# Altium schematic sheet Extension_Connectors.SchDoc: Extensions connectors
size A3; Organization: Use Organization_Name in ProjParam; Address1: Eliot Ferragni; Address2: STI-MOBOTS; Address3: EPFL; Address4: CH-1015 LAUSANNE; DocumentNumber: 11; Revision: A; SheetNumber: 11; SheetTotal: 11; ApprovedBy: Init ApprovedBy in DocParam; CheckedBy: Init CheckedBy in DocParam; Author: Init Author in DocParam; CompanyName: Init CompanyName in DocParam; DrawnBy: Init DrawBy in DocParam; Engineer: Init Engineer in DocParam; Title2: Top and bottom extension connectors; DocumentName: Init DocumentName in DocParam; ProjectName: Init ProjectName in DocParam
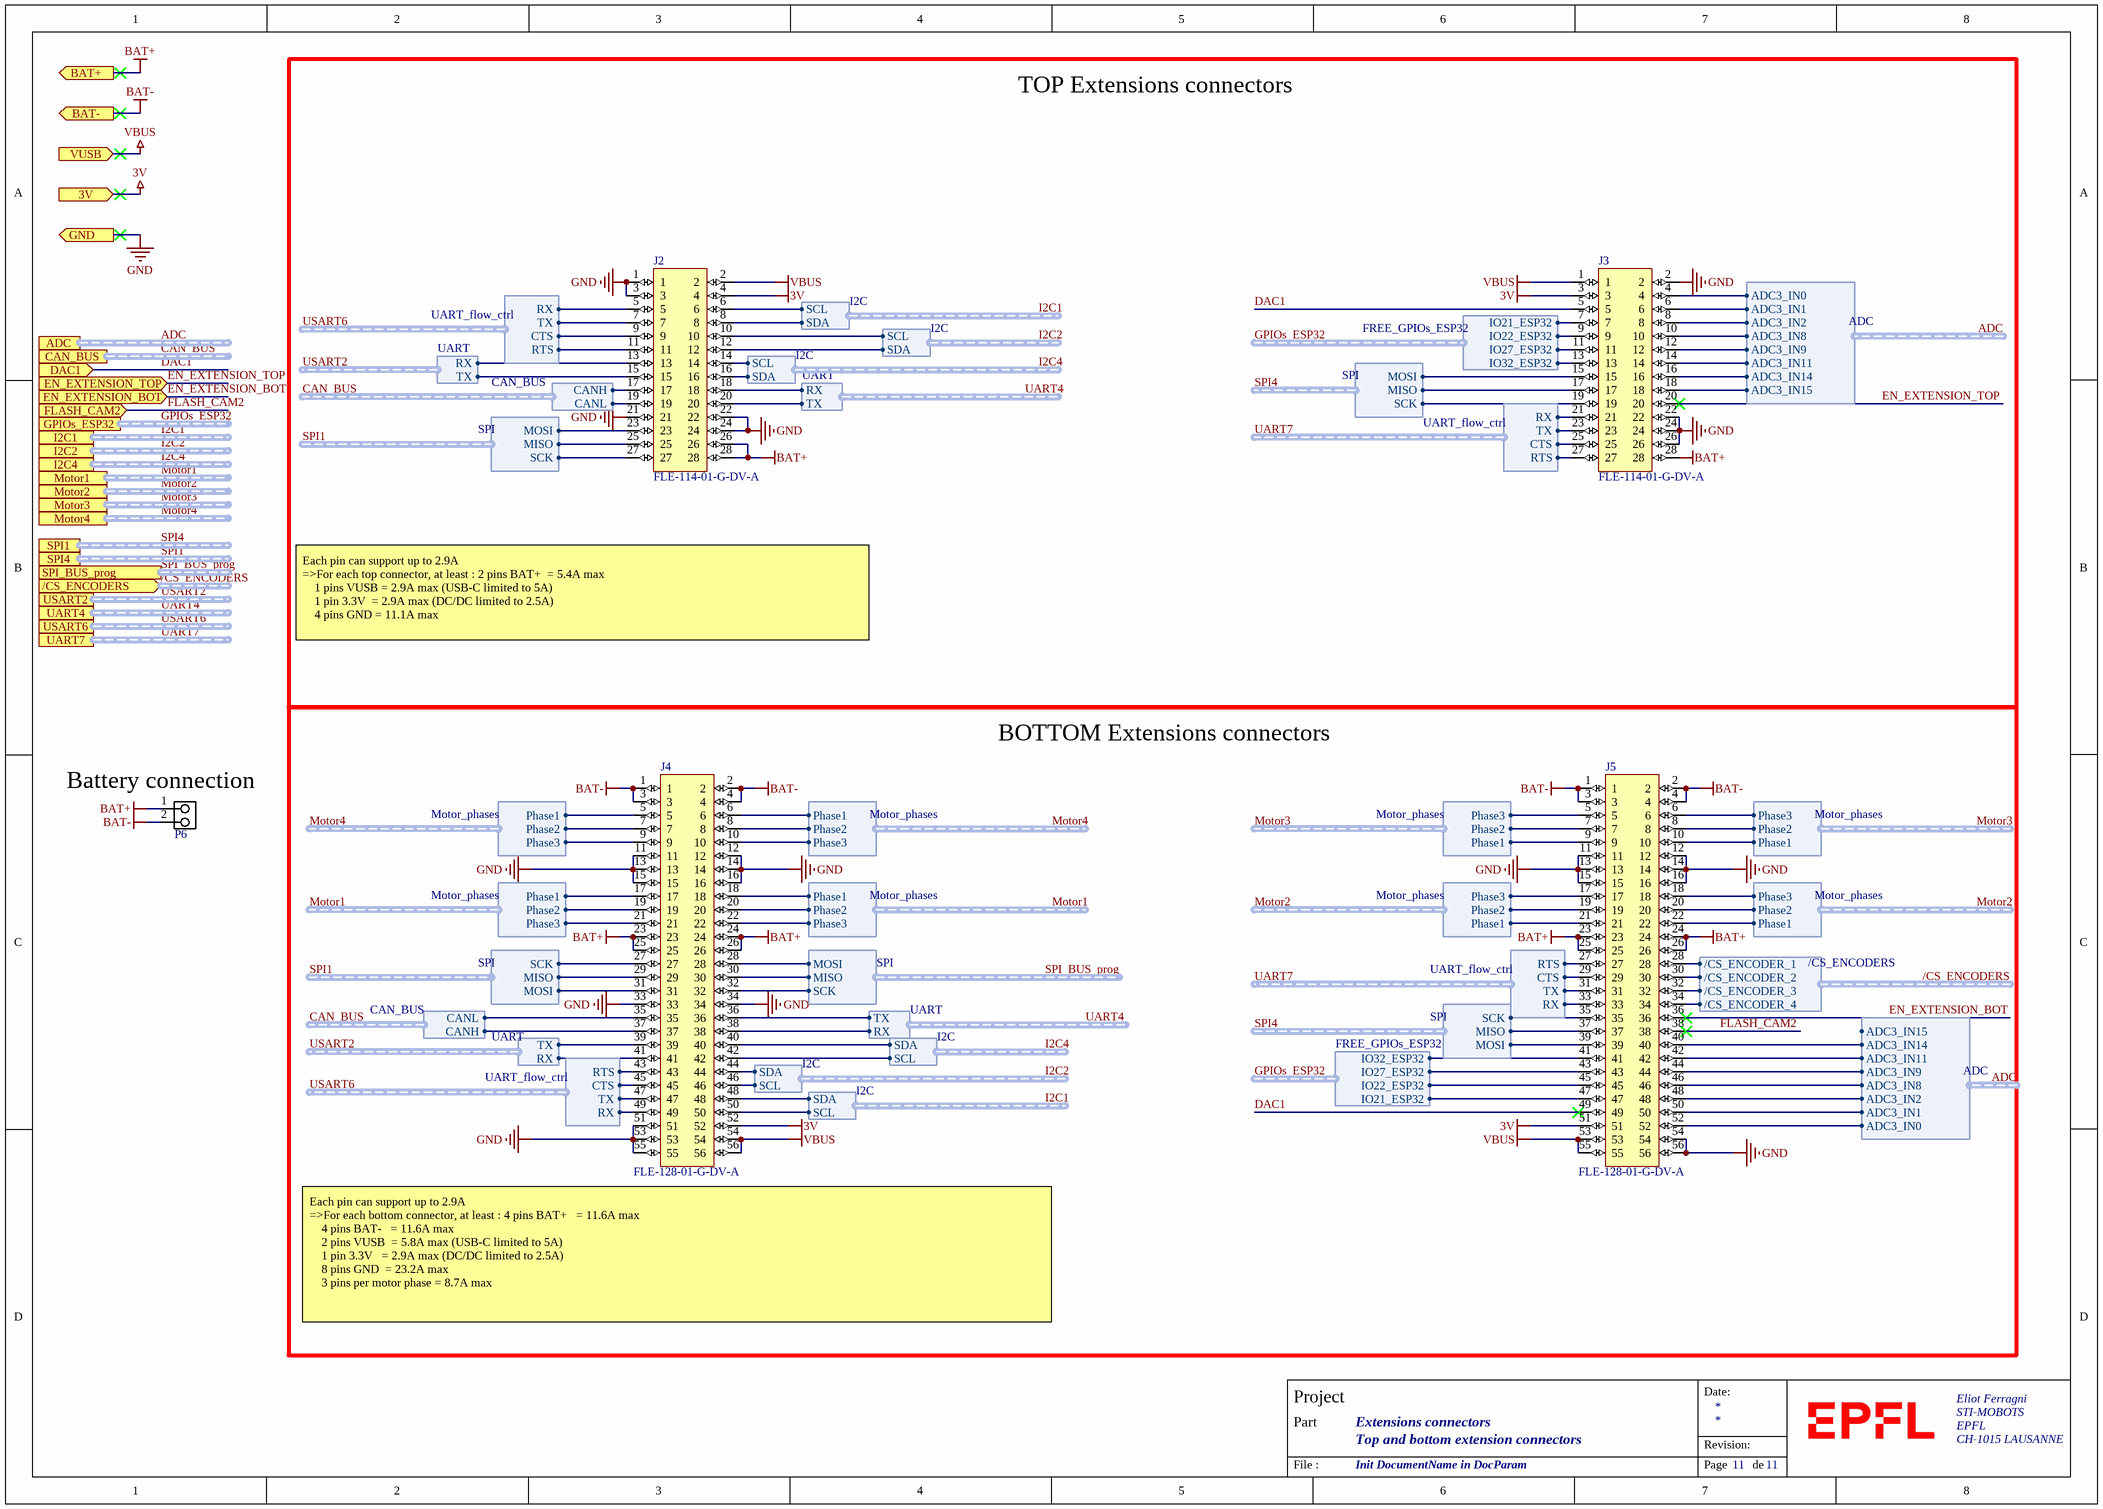
[diagram p0: Extension_Connectors.SchDoc]

## Parts
J2  FLE-114-01-G-DV-A  [FLE-114-01-G-DV-A]
J3  FLE-114-01-G-DV-A  [FLE-114-01-G-DV-A]
J4  FLE-128-01-G-DV-A  [FLE-128-01-G-DV-A]
J5  FLE-128-01-G-DV-A  [FLE-128-01-G-DV-A]
P6  2 power vias  [POWERVIAS_2]  (value not drawn)  (no BOM)

## Blocks framed on the sheet
TOP Extensions connectors: J2 J3
BOTTOM Extensions connectors: J4 J5

## Ports
3V (in), /CS_ENCODERS (in, harness /CS_ENCODERS), ADC (harness ADC), BAT+ (out), BAT- (out), CAN_BUS (harness CAN_BUS), DAC1 (in), EN_EXTENSION_BOT (in), EN_EXTENSION_TOP (in), FLASH_CAM2 (in), GND (out), GPIOs_ESP32 (harness FREE_GPIOs_ESP32), I2C1 (harness I2C), I2C2 (harness I2C), I2C4 (harness I2C), Motor1 (harness Motor_phases), Motor2 (harness Motor_phases), Motor3 (harness Motor_phases), Motor4 (harness Motor_phases), SPI1 (harness SPI), SPI4 (harness SPI), SPI_BUS_prog (harness SPI), UART4 (harness UART), UART7 (harness UART_flow_ctrl), USART2 (harness UART), USART6 (harness UART_flow_ctrl), VUSB (in)

## Harnesses
I2C: SDA, SCL
SPI: MISO, MOSI, SCK
UART_flow_ctrl: RX, TX, CTS, RTS
ADC: ADC3_IN0, ADC3_IN1, ADC3_IN2, ADC3_IN8, ADC3_IN9, ADC3_IN11, ADC3_IN14, ADC3_IN15
UART: RX, TX
CAN_BUS: CANL, CANH
/CS_ENCODERS: /CS_ENCODER_1, /CS_ENCODER_2, /CS_ENCODER_3, /CS_ENCODER_4
Motor_phases: Phase1, Phase2, Phase3
FREE_GPIOs_ESP32: IO22_ESP32, IO21_ESP32, IO27_ESP32, IO32_ESP32

## Nets
3V: J2.4 J3.3 J4.52 J5.51 ; port 3V
BAT+: J2.26 J2.28 J3.28 J4.23 J4.24 J4.25 J4.26 J5.23 J5.24 J5.25 J5.26 P6.1 ; port BAT+
BAT-: J4.1 J4.2 J4.3 J4.4 J5.1 J5.2 J5.3 J5.4 P6.2 ; port BAT-
GND: J2.1 J2.3 J2.21 J2.22 J2.24 J3.2 J3.22 J3.24 J3.26 J4.11 J4.12 J4.13 J4.14 J4.15 J4.16 J4.33 J4.34 J4.51 J4.53 J4.55 J5.11 J5.12 J5.13 J5.14 J5.15 J5.16 J5.54 J5.56 ; port GND
VBUS: J2.2 J3.1 J4.54 J4.56 J5.53 J5.55 ; port VUSB
/CS_ENCODERS./CS_ENCODER_1: J5.28 ; port /CS_ENCODERS./CS_ENCODER_1
/CS_ENCODERS./CS_ENCODER_2: J5.30 ; port /CS_ENCODERS./CS_ENCODER_2
/CS_ENCODERS./CS_ENCODER_3: J5.32 ; port /CS_ENCODERS./CS_ENCODER_3
/CS_ENCODERS./CS_ENCODER_4: J5.34 ; port /CS_ENCODERS./CS_ENCODER_4
ADC.ADC3_IN0: J3.4 J5.52 ; port ADC.ADC3_IN0
ADC.ADC3_IN1: J3.6 J5.50 ; port ADC.ADC3_IN1
ADC.ADC3_IN2: J3.8 J5.48 ; port ADC.ADC3_IN2
ADC.ADC3_IN8: J3.10 J5.46 ; port ADC.ADC3_IN8
ADC.ADC3_IN9: J3.12 J5.44 ; port ADC.ADC3_IN9
ADC.ADC3_IN11: J3.14 J5.42 ; port ADC.ADC3_IN11
ADC.ADC3_IN14: J3.16 J5.40 ; port ADC.ADC3_IN14
ADC.ADC3_IN15: J3.18 ; port ADC.ADC3_IN15
CAN_BUS.CANH: J2.17 J4.37 ; port CAN_BUS.CANH
CAN_BUS.CANL: J2.19 J4.35 ; port CAN_BUS.CANL
DAC1: J3.5 J5.49 ; port DAC1
EN_EXTENSION_BOT: J5.36 ; port EN_EXTENSION_BOT
EN_EXTENSION_TOP: J3.20 ; port EN_EXTENSION_TOP
FLASH_CAM2: J5.38 ; port FLASH_CAM2
GPIOs_ESP32.IO21_ESP32: J3.7 J5.47 ; port GPIOs_ESP32.IO21_ESP32
GPIOs_ESP32.IO22_ESP32: J3.9 J5.45 ; port GPIOs_ESP32.IO22_ESP32
GPIOs_ESP32.IO27_ESP32: J3.11 J5.43 ; port GPIOs_ESP32.IO27_ESP32
GPIOs_ESP32.IO32_ESP32: J3.13 J5.41 ; port GPIOs_ESP32.IO32_ESP32
I2C1.SCL: J2.6 J4.50 ; port I2C1.SCL
I2C1.SDA: J2.8 J4.48 ; port I2C1.SDA
I2C2.SCL: J2.10 J4.46 ; port I2C2.SCL
I2C2.SDA: J2.12 J4.44 ; port I2C2.SDA
I2C4.SCL: J2.14 J4.42 ; port I2C4.SCL
I2C4.SDA: J2.16 J4.40 ; port I2C4.SDA
Motor1.Phase1: J4.17 J4.18 ; port Motor1.Phase1
Motor1.Phase2: J4.19 J4.20 ; port Motor1.Phase2
Motor1.Phase3: J4.21 J4.22 ; port Motor1.Phase3
Motor2.Phase1: J5.21 J5.22 ; port Motor2.Phase1
Motor2.Phase2: J5.19 J5.20 ; port Motor2.Phase2
Motor2.Phase3: J5.17 J5.18 ; port Motor2.Phase3
Motor3.Phase1: J5.9 J5.10 ; port Motor3.Phase1
Motor3.Phase2: J5.7 J5.8 ; port Motor3.Phase2
Motor3.Phase3: J5.5 J5.6 ; port Motor3.Phase3
Motor4.Phase1: J4.5 J4.6 ; port Motor4.Phase1
Motor4.Phase2: J4.7 J4.8 ; port Motor4.Phase2
Motor4.Phase3: J4.9 J4.10 ; port Motor4.Phase3
SPI1.MISO: J2.25 J4.29 ; port SPI4.MISO
SPI1.MOSI: J2.23 J4.31 ; port SPI4.MOSI
SPI1.SCK: J2.27 J4.27 ; port SPI4.SCK
SPI4.MISO: J3.17 J5.37 ; port SPI1.MISO
SPI4.MOSI: J3.15 J5.39 ; port SPI1.MOSI
SPI4.SCK: J3.19 J5.35 ; port SPI1.SCK
SPI_BUS_prog.MISO: J4.30 ; port SPI_BUS_prog.MISO
SPI_BUS_prog.MOSI: J4.28 ; port SPI_BUS_prog.MOSI
SPI_BUS_prog.SCK: J4.32 ; port SPI_BUS_prog.SCK
UART4.RX: J2.18 J4.38 ; port UART4.RX
UART4.TX: J2.20 J4.36 ; port UART4.TX
UART7.CTS: J3.25 J5.29 ; port UART7.CTS
UART7.RTS: J3.27 J5.27 ; port UART7.RTS
UART7.RX: J3.21 J5.33 ; port UART7.RX
UART7.TX: J3.23 J5.31 ; port UART7.TX
USART2.RX: J2.13 J4.41 ; port USART2.RX
USART2.TX: J2.15 J4.39 ; port USART2.TX
USART6.CTS: J2.9 J4.45 ; port USART6.CTS
USART6.RTS: J2.11 J4.43 ; port USART6.RTS
USART6.RX: J2.5 J4.49 ; port USART6.RX
USART6.TX: J2.7 J4.47 ; port USART6.TX

## Buses and harness runs
harness /CS_ENCODERS = port /CS_ENCODERS
harness ADC = port ADC
harness CAN_BUS = port CAN_BUS
harness GPIOs_ESP32 = port GPIOs_ESP32
harness I2C1 = port I2C1
harness I2C2 = port I2C2
harness I2C4 = port I2C4
harness Motor1 = port Motor1
harness Motor2 = port Motor2
harness Motor3 = port Motor3
harness Motor4 = port Motor4
harness SPI1 = port SPI4
harness SPI4 = port SPI1
harness SPI_BUS_prog = port SPI_BUS_prog
harness UART4 = port UART4
harness UART7 = port UART7
harness USART2 = port USART2
harness USART6 = port USART6

## Notes on the sheet
- Each pin can support up to 2.9A
  =>For each top connector, at least :	2 pins BAT+ 	= 5.4A max
  1 pins VUSB	= 2.9A max (USB-C limited to 5A)
  1 pin 3.3V		= 2.9A max (DC/DC limited to 2.5A)
  4 pins GND	= 11.1A max
- (near P6) Battery connection
- (near J4) Each pin can support up to 2.9A
  =>For each bottom connector, at least :	4 pins BAT+ 		= 11.6A max
  4 pins BAT- 		= 11.6A max
  2 pins VUSB		= 5.8A max (USB-C limited to 5A)
  1 pin 3.3V			= 2.9A max (DC/DC limited to 2.5A)
  8 pins GND		= 23.2A max
  3 pins per motor phase	= 8.7A max
- Date:
- Project
- Part
- Revision:
- File :
- Page
- de

## Library data of the parts
J2 J3 = FLE-114-01-G-DV-A: .050 MICRO STRIPS; Manufacturer: Samtec; Number of Contacts: 28; Gender: Female; Pitch: 1.27mm; Note: To buy by assembler; Supplier 1: Digi-Key; Stock 1: 0; Pricing 1: 1 = 4,47000 (USD); RoHS: Yes; Contact Plating: Gold; Number of Rows: 2; Termination: Solder; ComponentLink1URL: http://suddendocs.samtec.com/prints/fle-1xx-xx-xx-dv-x-mkt.pdf?src-supplier=Digi-Key; ComponentLink1Description: http://suddendocs.samtec.com/prints/fle-1xx-xx-xx-dv-x-mkt.pdf?src-supplier=Digi-Key; ComponentLink2URL: http://cloud.samtec.com/catalog_english/FLE_SM.PDF?src-supplier=Avnet; ComponentLink2Description: http://cloud.samtec.com/catalog_english/FLE_SM.PDF?src-supplier=Avnet; Supplier Part Number 1: FLE-114-01-G-DV-A-ND; Manufacturer Part Number: FLE-114-01-G-DV-A; Type: SMD; Package / Case: Connector
J4 J5 = FLE-128-01-G-DV-A: .050 MICRO STRIPS; Manufacturer: Samtec; Number of Contacts: 56; Gender: Female; Contact Resistance: 15mR; Pitch: 1.27mm; Note: To buy by assembler; Supplier 1: Digi-Key; Stock 1: 0; Pricing 1: 125 = 5,40800 (USD); RoHS: Yes; Contact Plating: Gold; Contact Material: Bronze; Housing Color: Black; Housing Material: Polymer; Min Operating Temperature: -55°C; Max Operating Temperature: 125°C; Termination: Solder; Number of Rows: 2; Packaging: Tape and Reel; Orientation: Straight; Length: 35.67mm; Depth: 3.33mm; ComponentLink1URL: http://components.arrow.com/part/dataview/0323_04389637?src-supplier=Arrow+Europe; ComponentLink1Description: http://components.arrow.com/part/dataview/0323_04389637?src-supplier=Arrow+Europe; ComponentLink2URL: http://cloud.samtec.com/catalog_english/FLE_SM.PDF?src-supplier=Avnet; ComponentLink2Description: http://cloud.samtec.com/catalog_english/FLE_SM.PDF?src-supplier=Avnet; Supplier Part Number 1: FLE-128-01-G-DV-A-K-TR-ND; Manufacturer Part Number: FLE-128-01-G-DV-A; Type: SMD; Package / Case: Connector
P6 = 2 power vias: 2 Pins; Type: SMD